# Altium schematic sheet Mako DSP USBR1.2.SchDoc
size A
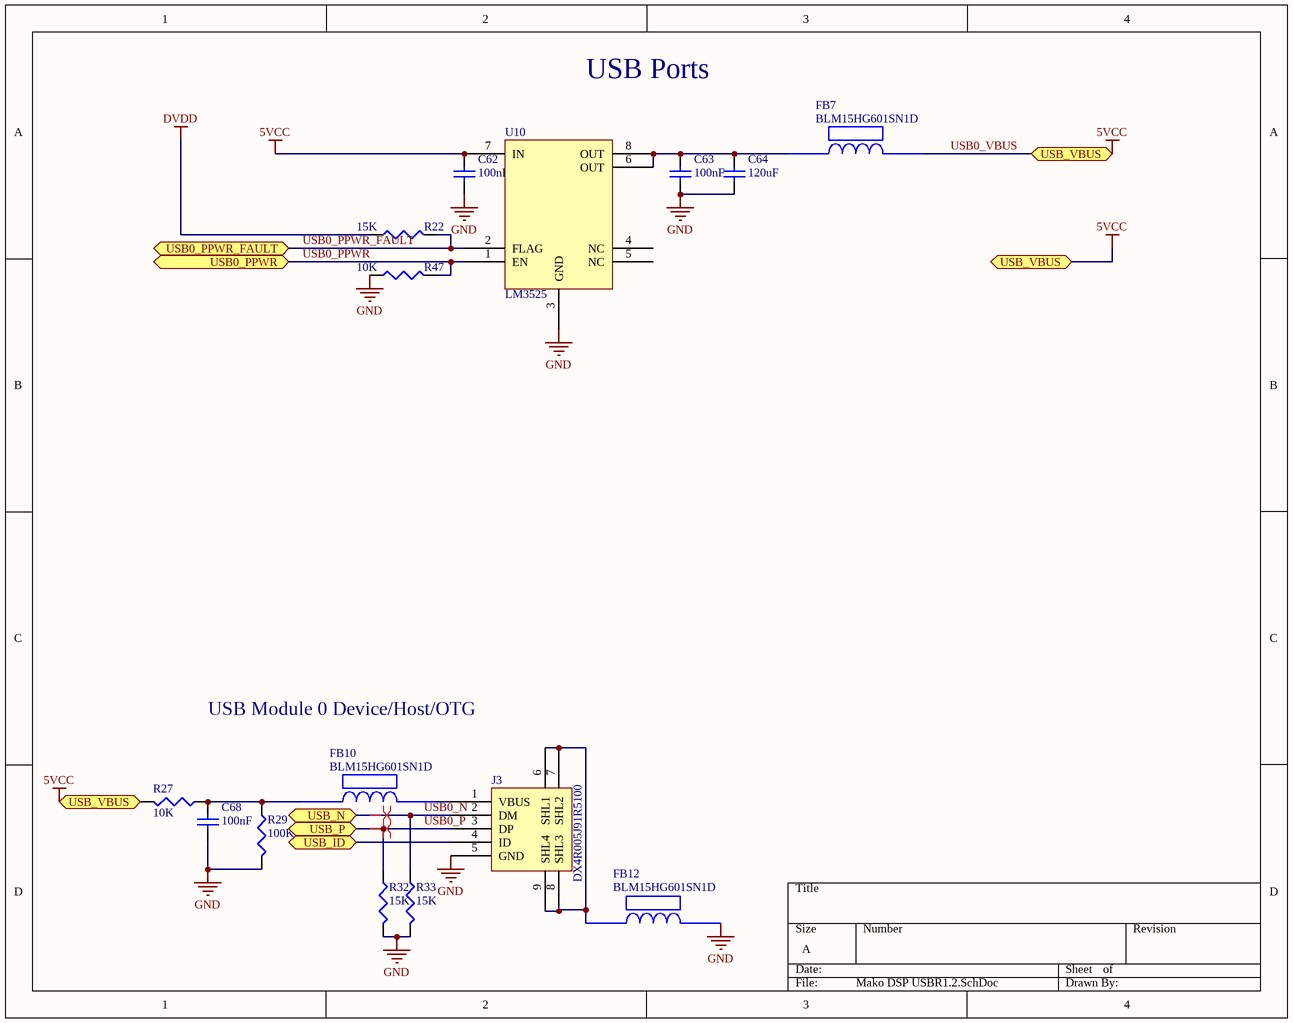
[diagram p0: Mako DSP USBR1.2.SchDoc]

## Parts
C62  value 100nF  [1608[0603]]  (hidden comment: Cap Semi)
C63  value 100nF  [1608[0603]]  (hidden comment: Cap Semi)
C64  value 120uF  [1608[0603]]  (hidden comment: Cap Semi)
C68  value 100nF  [1608[0603]]  (hidden comment: Cap Semi)
FB7  BLM15HG601SN1D  [BLM18PG121SN1D]
FB10  BLM15HG601SN1D  [BLM18PG121SN1D]
FB12  BLM15HG601SN1D  [BLM18PG121SN1D]
J3  DX4R005J91R5100  [Micro USB Circular Holes Only]
R22  value 15K  [J1-0603]  (hidden comment: Res3)
R27  value 10K  [J1-0603]  (hidden comment: Res3)
R29  value 100K  [J1-0603]  (hidden comment: Res3)
R32  value 15K  [J1-0603]  (hidden comment: Res3)
R33  value 15K  [J1-0603]  (hidden comment: Res3)
R47  value 10K  [J1-0603]  (hidden comment: Res3)
U10  LM3525  [LM3525]

## Ports
USB0_PPWR (bidir), USB0_PPWR_FAULT (bidir), USB_ID (bidir), USB_N (bidir), USB_P (bidir), USB_VBUS (bidir)

## Nets
DVDD: R22.1
GND: C62.1 C63.1 C64.1 C68.1 FB12.2 J3.5(GND) R29.2 R32.2 R33.2 R47.1 U10.3(GND)
USB0_VBUS: C62.2 FB7.2 R27.2 U10.7(IN) ; port USB_VBUS  [also labelled 5VCC]
USB0_N: J3.2(DM) R33.1 ; port USB_N
USB0_P: J3.3(DP) R32.1 ; port USB_P
USB0_PPWR: R47.2 U10.1(EN) ; port USB0_PPWR
USB0_PPWR_FAULT: R22.2 U10.2(FLAG) ; port USB0_PPWR_FAULT
USB_ID: J3.4(ID) ; port USB_ID
NetC63_2: C63.2 C64.2 FB7.1 U10.6(OUT) U10.8(OUT)
NetC68_2: C68.2 FB10.1 R27.1 R29.1
NetFB10_2: FB10.2 J3.1(VBUS)
NetFB12_1: FB12.1 J3.6(SHL1) J3.7(SHL2) J3.8(SHL3) J3.9(SHL4)

Not connected (* = marked no-connect by the designer): U10 4(NC) 5(NC)

## Layout directives
differential pair: USB0_N, USB0_P

## Notes on the sheet
- USB Ports
- USB Module 0 Device/Host/OTG

## Library data of the parts
C62-C64 C68 = Cap Semi: Capacitor (Semiconductor SIM Model); Published: 8-Jun-2000; LatestRevisionDate: 29-May-2009; LatestRevisionNote: IPC-7351 Footprint Added.; PackageReference: C1206; Publisher: Altium Limited; PackageDescription: Chip Capacitor
J3 = Micro USB: Micro USB Jack B
R22 R27 R29 R32 R33 R47 = Res3: Resistor; Published: 8-Jun-2000; LatestRevisionDate: 29-May-2009; LatestRevisionNote: IPC-7351 Footprint Added.; PackageReference: J1-0603; Publisher: Altium Limited; PackageDescription: Chip Resistor